# Altium schematic sheet RS485-SPI.SchDoc
size OrCAD A
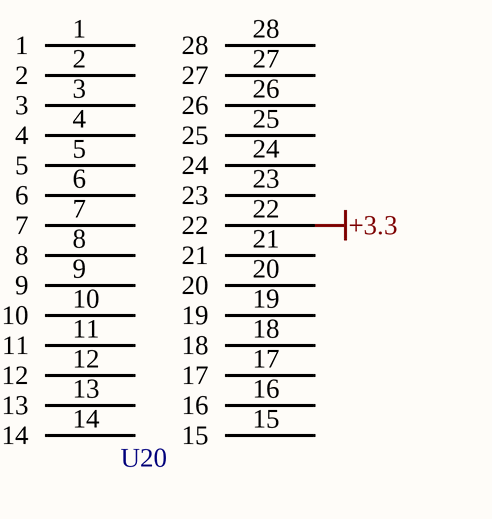
[diagram p0: RS485-SPI.SchDoc]

## Parts
U20  max3140  (value not drawn)

## Nets
+3.3: U20.22

Not connected (* = marked no-connect by the designer): U20 1 2 3 4 5 6 7 8 9 10 11 12 13 14 15 16 17 18 19 20 21 23 24 25 26 27 28

## Notes on the sheet
- Title
- Size:
- Date:
- Orcad A
- Number:
- Time:
- Revision:
- Sheet
- of
- ZLS Corporation
- 7801 North Lamar Blvd.
- Suite E-184
- Austin, Texas 78752  USA
- (512) 453-0288
- File: